# EAGLE design SparkFun_TPL5110_Nano_Power_Switch (EAGLE 9.4.0)
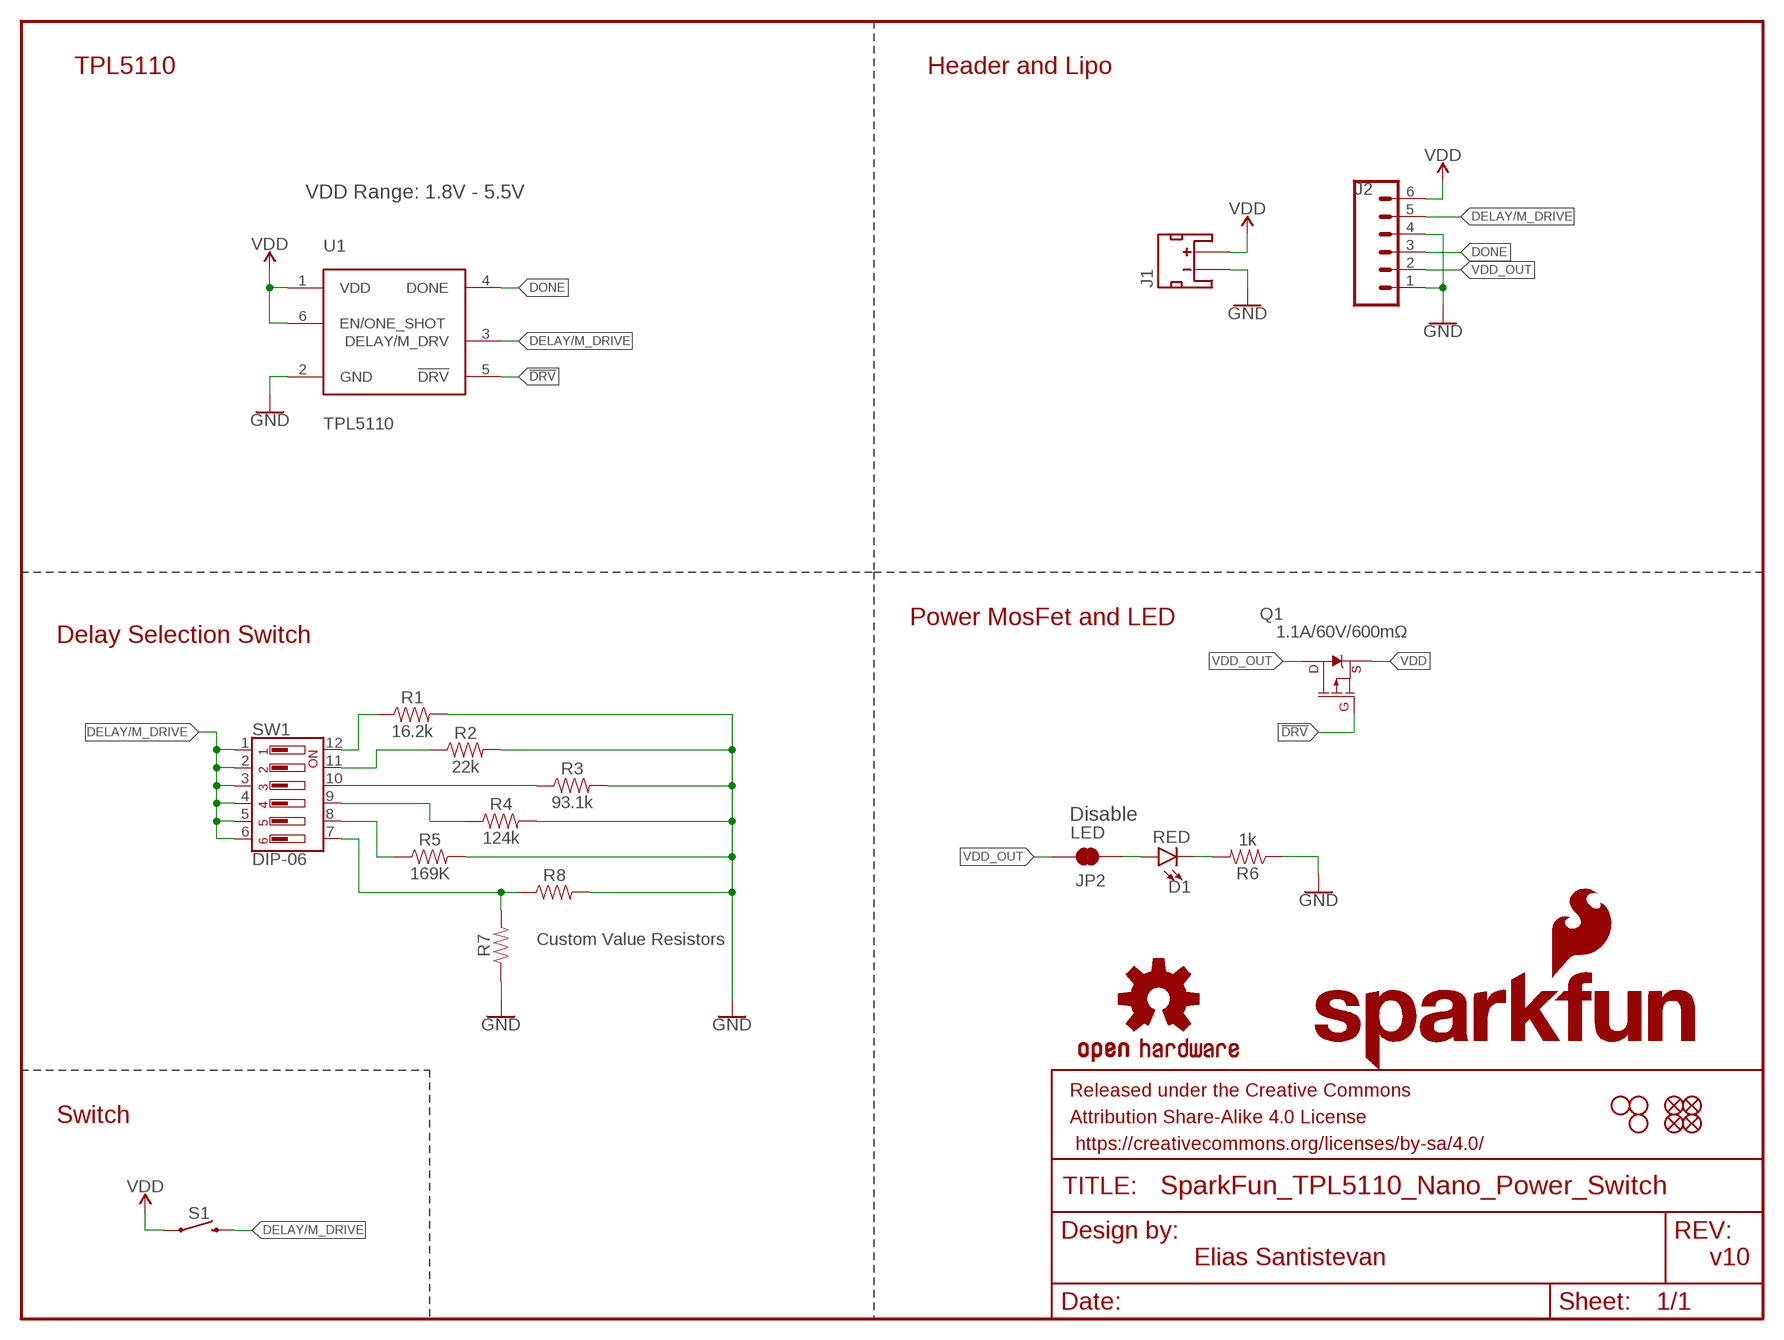
[diagram p0: schematic, sheet 1]

## Parts
D1  RED  LED-RED0603  [LED-0603]
FD1  FIDUCIALUFIDUCIAL  [FIDUCIAL-MICRO]
FD2  FIDUCIALUFIDUCIAL  [FIDUCIAL-MICRO]
FD3  FIDUCIALUFIDUCIAL  [FIDUCIAL-MICRO]
FD4  FIDUCIALUFIDUCIAL  [FIDUCIAL-MICRO]
FRAME1  FRAME-LETTER  [CREATIVE_COMMONS]
H1  STAND-OFFTIGHT  [STAND-OFF-TIGHT]
H2  STAND-OFFTIGHT  [STAND-OFF-TIGHT]
H4  STAND-OFFTIGHT  [STAND-OFF-TIGHT]
J1  JST_2MM_MALE  [JST-2-SMD]
J2  CONN_06NO_SILK_NO_POP  [1X06_NO_SILK]
JP2  LED  JUMPER-SMT_2_NC_TRACE_SILK  [SMT-JUMPER_2_NC_TRACE_SILK]
LOGO1  SFE_LOGO_NAME.1_INCH  [SFE_LOGO_NAME_.1]
LOGO2  OSHW-LOGOS  [OSHW-LOGO-S]
LOGO3  SFE_LOGO_FLAME.1_INCH  [SFE_LOGO_FLAME_.1]
Q1  1.1A/60V/600mΩ  MOSFET_PCH-SI2309DS  [SOT23-3]
R1  16.2k  16.2KOHM-0603-1/10W-1%  [0603]
R2  22k  22KOHM-0603-1/10W-1%  [0603]
R3  93.1k  93.1KOHM  [0603]
R4  124k  124KOHM  [0603]
R5  169K  169KOHM  [0603]
R6  1k  1KOHM-0603-1/10W-1%  [0603]
R7  RESISTOR0603  [0603]
R8  RESISTORAXIAL-0.3  [AXIAL-0.3]
S1  MOMENTARY-SWITCH-SPST-SMD-5.2MM-TALL  [TACTILE_SWITCH_SMD_5.2MM]
SW1  DIP-06  [DIPSWITCH-06-SMD]
U1  TPL5110  [SOT23-6]

## Nets
!DRV: Q1.1(G) U1.5(!DRV)
DELAY/M_DRIVE: J2.5 S1.3 SW1.1 SW1.2 SW1.3 SW1.4 SW1.5 SW1.6 U1.3(DELAY/M_DRV)
DONE: J2.3 U1.4(DONE)
GND: J1.1(-) J2.1 J2.4 R1.2 R2.2 R3.2 R4.2 R5.2 R6.1 R7.1 R8.P$2 U1.2(GND)
N$1: D1.C R6.2
N$4: R1.1 SW1.12
N$5: R2.1 SW1.11
N$6: R3.1 SW1.10
N$7: R4.1 SW1.9
N$8: R5.1 SW1.8
N$9: R7.2 R8.P$1 SW1.7
N$11: D1.A JP2.1
VDD: J1.2(+) J2.6 Q1.2(S) S1.1 U1.1(VDD) U1.6(EN/ONE_SHOT)
VDD_OUT: J2.2 JP2.2 Q1.3(D)
Unconnected: J1.NC1(PAD1) J1.NC2(PAD2)

## Notes on the sheet
- TPL5110 | Header and Lipo
- VDD Range: 1.8V - 5.5V
- Power MosFet and LED
- Delay Selection Switch
- Disable
- Custom Value Resistors
- Switch
- Elias Santistevan | v10

## Library data of the parts
D1 = SparkFun-LED:LED-RED: Red SMD LED Used in manufacturing of most products at SparkFun Packages: 0603 - SMD 0603 package [Product Link] <http://docs.avagotech.com/docs/AV02-0551EN> 0603 SMART - SMD 0603 SMART package ( more efficient and expensive)[Product Link] <http://www.osram-os.com/Graphics/XPic2/00077099_0.pdf> 1206 - SMD1206 package [Product Link] <https://www.sparkfun.com/datasheets/DevTools/LilyPad/Q150OVS4.pdff> SparkFun Products: Pro Mini 328 -5V <https://www.sparkfun.com/products/821> RedBoard <https://www.sparkfun.com/products/12757> IOIO-OTG <https://www.sparkfun.com/products/13613>; PROD_ID: DIO-00819
FD1-FD4 = SparkFun-Aesthetics:FIDUCIAL: Fiducial Alignment Points Point-of-reference for pick-and-place machines and other optical instruments.
FRAME1 = SparkFun-Aesthetics:FRAME-LETTER: Schematic Frame - Letter Standard 8.5x11 US Letter frame
H1 H2 H4 = SparkFun-Hardware:STAND-OFF: Stand Off Drill holes for mechanically mounting via screws, standoffs, etc. Note: Use the keepout ring to avoid running the screw head into surrounding components. Variant Overviews STAND-OFF - Mechanical footprint for a #4 phillips button head screw. STAND-OFF-TIGHT - Mechanical footprint for a #4 phillips button head screw, Example SparkFun Products Screw - Phillips Head (1/4", 4-40, 10 pack) <https://www.sparkfun.com/products/10453> (PRT-10453) Screw - Phillips Head (1/2", 4-40, 10 pack) <https://www.sparkfun.com/products/10452> (PRT-10452) Screw - Phillips Head (3/4", 4-40, 10 pack) <https://www.sparkfun.com/products/10451> (PRT-10451) Screw - Phillips Head (1", 4-40, 10 pack) <https://www.sparkfun.com/products/10450> (PRT-10450)
J1 = SparkFun-Connectors:JST_2MM_MALE: JST 2MM MALE RA CONNECTOR Two pin, compact surface mount connector. Commonly used as a battery input connection point. We really like the solid locking feeling and high current rating on these small connectors. We use these all the time as battery connectors. Mates to single-cell LiPo batteries. Here is the connector we sell at SparkFun: JST Right Angle Connector - White <https://www.sparkfun.com/products/8612> (PRT-08612) Datasheet <http://www.sparkfun.com/datasheets/Prototyping/Connectors/JST-Horizontal.pdf> It was used on these SparkFun products: SparkFun MOSFET Power Controller <https://www.sparkfun.com/products/11214> (PRT-11214) SparkFun Battery Babysitter - LiPo Battery Manager <https://www.sparkfun.com/products/13777> (PRT-13777) And many, many others that required a lipo battery connection.; PROD_ID: CONN-11443; SF_ID: PRT-08612
J2 = SparkFun-Connectors:CONN_06: Multi connection point. Often used as Generic Header-pin footprint for 0.1 inch spaced/style header connections On any of the 0.1 inch spaced packages, you can populate with these: Break Away Headers - Straight <https://www.sparkfun.com/products/116> (PRT-00116) Break Away Male Headers - Right Angle <https://www.sparkfun.com/products/553> (PRT-00553) Female Headers <https://www.sparkfun.com/products/115> (PRT-00115) Break Away Headers - Machine Pin <https://www.sparkfun.com/products/117> (PRT-00117) Break Away Female Headers - Swiss Machine Pin <https://www.sparkfun.com/products/743> (PRT-00743) Arduino Stackable Header - 6 Pin <https://www.sparkfun.com/products/9280> (PRT-09280) For SCREWTERMINALS and SPRING TERMINALS visit here: Screw Terimnals on SparkFun.com <https://www.sparkfun.com/search/results?term=Screw+Terminals> (5mm/3.5mm/2.54mm spacing) This device is also useful as a general connection point to wire up your design to another part of your project. Our various solder wires solder well into these plated through hole pads. Hook-Up Wire - Assortment (Stranded, 22 AWG) <https://www.sparkfun.com/products/11375> (PRT-11375) Hook-Up Wire - Assortment (Solid Core, 22 AWG) <https://www.sparkfun.com/products/11367> (PRT-11367) View the entire wire category on our website here <https://www.sparkfun.com/categories/141>
JP2 = SparkFun-Jumpers:JUMPER-SMT_2_NC_TRACE: Normally closed trace jumper This jumper has a trace between two pads so it's normally closed (NC). Use a razor knife to open the connection. For best results follow the IPC guidelines for cutting traces: Cutout at least 0.063 mm (0.005 in). Remove all loose material to clean up the cut area. Seal the cut with an approved epoxy. Reapply solder to reclose the connection.
LOGO1 = SparkFun-Aesthetics:SFE_LOGO_NAME: SparkFun Font Logo This is the SparkFun name logo. The logo on the schematic will always be the same size; the package variant is the height of the flame part of the logo (or the height the flame would be, if it were drawn). Default layer for the logo on the board is tSilk.
LOGO2 = SparkFun-Aesthetics:OSHW-LOGO: Open-Source Hardware (OSHW) Logo This logo indicates the piece of hardware it is found on incorporates a OSHW license and/or adheres to the definition of open source hardware found here: http://freedomdefined.org/OSHW
LOGO3 = SparkFun-Aesthetics:SFE_LOGO_FLAME: SparkFun Flame Logo This is the SparkFun flame logo. The logo on the schematic will always be the same size; the package variant is the height of the flame. Default layer for the logo on the board is tSilk.
Q1 = SparkFun-DiscreteSemi:MOSFET_PCH: P-channel MOSFETs Voltage controlled devices that allow control of high current outputs. SparkFun Products: SparkFun ESP32 Thing <https://www.sparkfun.com/products/13907> SparkFun ESP8266 Thing <https://www.sparkfun.com/products/13231> SparkFun Pi Servo HAT V2 <https://www.sparkfun.com/products/15316> DMG2305UX-7 (20V/4.2A/SOT23-3); PROD_ID: TRANS-08285
R1 = SparkFun-Resistors:16.2KOHM: 16.2kΩ resistor A resistor is a passive two-terminal electrical component that implements electrical resistance as a circuit element. Resistors act to reduce current flow, and, at the same time, act to lower voltage levels within circuits. - Wikipedia; PROD_ID: RES-12187
R2 = SparkFun-Resistors:22KOHM: 22kΩ resistor A resistor is a passive two-terminal electrical component that implements electrical resistance as a circuit element. Resistors act to reduce current flow, and, at the same time, act to lower voltage levels within circuits. - Wikipedia; PROD_ID: RES-07853
R3 = SparkFun-Resistors:93.1KOHM: 93.1kΩ resistor A resistor is a passive two-terminal electrical component that implements electrical resistance as a circuit element. Resistors act to reduce current flow, and, at the same time, act to lower voltage levels within circuits. - Wikipedia; PROD_ID: RES-14393
R4 = SparkFun-Resistors:124KOHM: 124kΩ resistor A resistor is a passive two-terminal electrical component that implements electrical resistance as a circuit element. Resistors act to reduce current flow, and, at the same time, act to lower voltage levels within circuits. - Wikipedia; PROD_ID: RES-14395
R5 = SparkFun-Resistors:169KOHM: 169kΩ resistor A resistor is a passive two-terminal electrical component that implements electrical resistance as a circuit element. Resistors act to reduce current flow, and, at the same time, act to lower voltage levels within circuits. - Wikipedia; PROD_ID: RES-14394
R6 = SparkFun-Resistors:1KOHM: 1kΩ resistor A resistor is a passive two-terminal electrical component that implements electrical resistance as a circuit element. Resistors act to reduce current flow, and, at the same time, act to lower voltage levels within circuits. - Wikipedia; PROD_ID: RES-07856
R7 R8 = SparkFun-Resistors:RESISTOR: Generic Resistor Package
S1 = SparkFun-Switches:MOMENTARY-SWITCH-SPST: Momentary Switch (Pushbutton) - SPST Normally-open (NO) SPST momentary switches (buttons, pushbuttons). Variants PTH-12MM - 12mm square, through-hole Momentary Pushbutton Switch - 12mm Square <https://www.sparkfun.com/products/9190> (COM-09190) PTH-6.0MM, PTH-6.0MM-KIT - 6.0mm square, through-hole Mini Pushbutton Switch <https://www.sparkfun.com/products/97> (COM-00097) KIT package intended for soldering kit's - only one side of pads' copper is exposed. PTH-RIGHT-ANGLE-KIT - Right-angle, through-hole Right Angle Tactile Button <https://www.sparkfun.com/products/10791> - Used on SparkFun BigTime Watch Kit <https://www.sparkfun.com/products/11734> SMD-12MM - 12mm square, surface-mount Tactile Button - SMD (12mm) <https://www.sparkfun.com/products/12993> (COM-12993) Used on SparkFun PicoBoard <https://www.sparkfun.com/products/11888> SMD-4.5MM - 4.5mm Square Trackball Switch Used on SparkFun Blackberry Trackballer Breakout <https://www.sparkfun.com/products/13169> SMD-4.6MMX2.8MM - 4.60mm x 2.80mm, surface mount Used on SparkFun SAMD21 Mini Breakout <https://www.sparkfun.com/products/13664> SMD-5.2MM, SMD-5.2-REDUNDANT - 5.2mm square, surface-mount Mini Pushbutton Switch - SMD <https://www.sparkfun.com/products/8720> (COM-08720) Used on Arduino Pro Mini <https://www.sparkfun.com/products/11114> REDUNDANT package connects both switch circuits together SMD-6.0X3.5MM - 6.0 x 3.5mm, surface mount Momentary Reset Switch SMD <https://www.sparkfun.com/products/8229> (COM-08229) SMD-6.2MM-TALL - 6.2mm square, surface mount Tactile Button - SMD (6mm) <https://www.sparkfun.com/products/12992> Used on SparkFun Digital Sandbox <https://www.sparkfun.com/products/12651> SMD-RIGHT-ANGLE - Right-angle, surface mount Used on SparkFun Block for Intel® Edison - Arduino <https://www.sparkfun.com/products/13036>; PROD_ID: SWCH-14139
SW1 = SparkFun-Switches:DIP-06; PROD_ID: --------
U1 = SparkFun-IC-Power:TPL5110: TPL5110 Nano-Power System Timer for Power Gating The TPL5110 Nano Timer is a low power timer with an integrated MOSFET driver designed for power gating in duty cycled or battery-powered applications. Consuming only 35 nA, the TPL5110 can enable the power supply line and drastically reduce the overall system stand by current during the sleep time.; PROD_ID: IC-14387

## Board
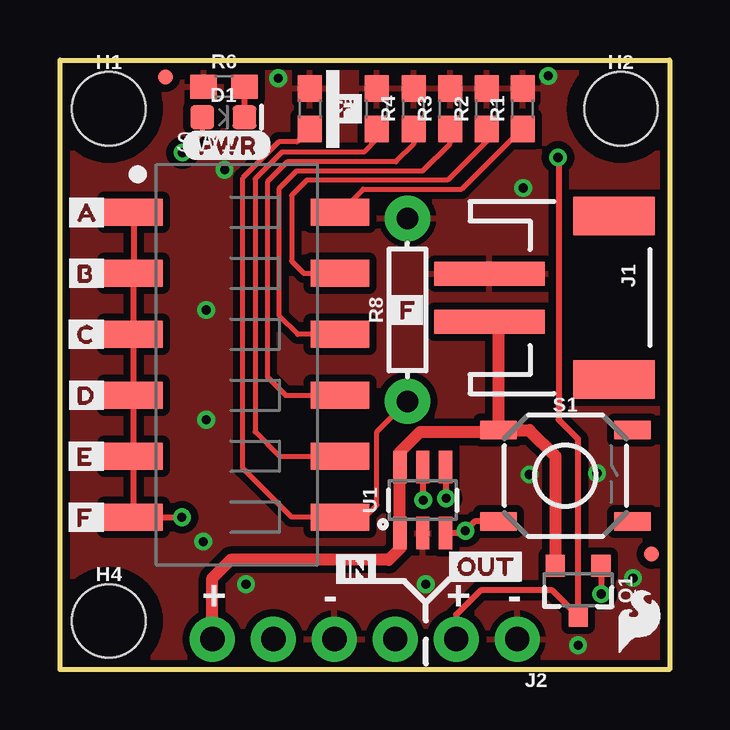
[diagram p1: board, top side]
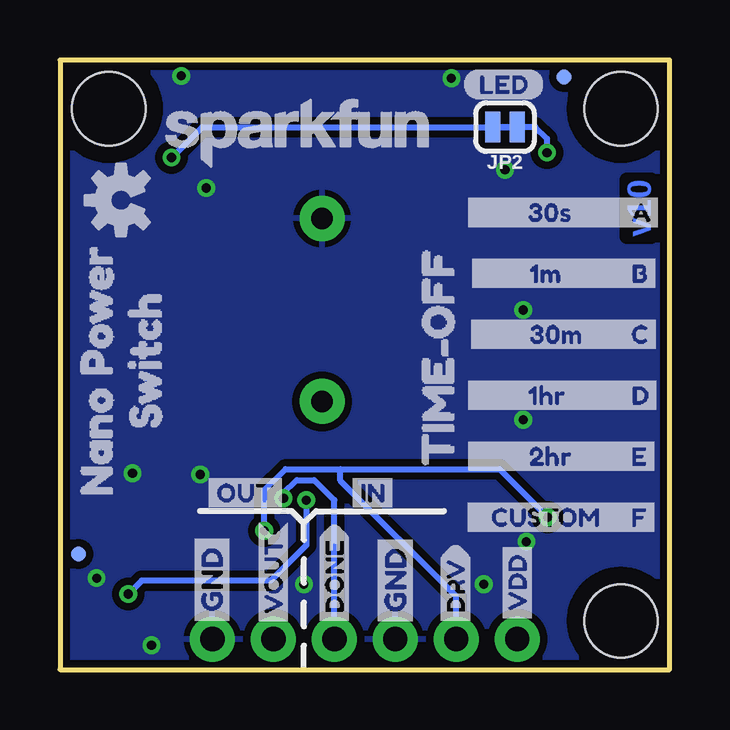
[diagram p2: board, bottom side, seen from below]

Size 25.4 x 25.4 mm. Coordinates in mm from the lower left corner, seen from the top.
Outline: 0,0 0,25.4 25.4,25.4 25.4,0 0,0
Copper layers (1*16): Top 0.035mm / dielectric 1.5mm / Bottom 0.035mm
Design rules "SparkFun-2-layer-TIGHT": minimum track width 7mil, minimum drill 15mil, track to track 7mil, track to pad 7mil, pad to pad 7mil, via to via 7mil, smd to smd 7mil, copper to edge 7mil, drill to drill 7mil, minimum pad ring 7mil, minimum via ring 7mil, stop-mask expansion 4mil, vias tented up to drill 25mil, thermal gap 10mil

### Footprints (pad centres in the part's own frame; a part is rotated, then mirrored left to right if it is on the bottom)
LED-0603 = smd 1 x 1: A -0.877,0; C 0.877,0
FIDUCIAL-MICRO = smd 0.635 x 0.635: 1 0,0
STAND-OFF-TIGHT = hole 3.048: 0,0
JST-2-SMD = smd 1 x 4.6: 1 -1,-3.7; 2 1,-3.7 | smd 1.6 x 3.4: NC1 -3.4,1.5; NC2 3.4,1.5
1X06_NO_SILK = drill 1.016 pad 1.88: 1 0,0; 2 2.54,0; 3 5.08,0; 4 7.62,0; 5 10.16,0; 6 12.7,0
SMT-JUMPER_2_NC_TRACE_SILK = smd 0.635 x 1.27: 1 -0.508,0; 2 0.508,0
SOT23-3 = smd 0.8 x 0.9: 1 -0.95,-1; 2 0.95,-1; 3 0,1.1
0603 = smd 1.1 x 1: 1 -0.85,0; 2 0.85,0
AXIAL-0.3 = drill 0.9 pad 1.88: P$1 -3.81,0; P$2 3.81,0
TACTILE_SWITCH_SMD_5.2MM = smd 1.524 x 0.762: 1 -2.794,1.905; 2 2.794,1.905; 3 -2.794,-1.905; 4 2.794,-1.905
DIPSWITCH-06-SMD = smd 1.13 x 2.44: 1 -6.35,-4.3; 2 -3.81,-4.3; 3 -1.27,-4.3; 4 1.27,-4.3; 5 3.81,-4.3; 6 6.35,-4.3; 7 6.35,4.3; 8 3.81,4.3; 9 1.27,4.3; 10 -1.27,4.3; 11 -3.81,4.3; 12 -6.35,4.3
SOT23-6 = smd 0.55 x 1.35: 1 -0.95,-1.375; 2 0,-1.375; 3 0.95,-1.375; 4 0.95,1.375; 5 0,1.375; 6 -0.95,1.375

### Placement (x,y rotation side)
D1  6.81,23.01 0 top
FD1  4.39,24.69 0 bottom
FD2  4.39,24.69 0 top
FD3  24.64,4.83 0 bottom
FD4  24.64,4.83 0 top
FRAME1  -10.41,-15.49 0 top  (outside the outline)
H1  2.03,23.37 0 top
H2  23.37,23.37 0 top
H4  2.03,2.03 0 top
J1  21.59,15.49 270 top
J2  19.05,1.27 180 top
JP2  6.86,22.61 180 bottom
LOGO1  15.49,22.35 0 bottom
LOGO2  22.86,19.56 90 bottom
LOGO3  24.13,2.03 0 top
Q1  21.59,3.33 180 top
R1  19.28,23.37 90 top
R2  17.78,23.37 90 top
R3  16.26,23.37 90 top
R4  14.73,23.37 90 top
R5  13.21,23.37 90 top
R6  6.83,24.28 0 top
R7  10.41,23.37 270 top
R8  14.48,14.99 90 top
S1  21.06,8.08 0 top
SW1  7.37,12.7 270 top
U1  15.11,7.06 0 top
U$1  [DONE0]  13.97,1.68 90 bottom
U$2  [GND-03]  19.08,1.63 90 bottom
U$3  [VOUT0]  16.51,1.63 90 bottom
U$4  [GND-03]  11.43,1.6 90 bottom
U$5  [VDD0]  6.35,1.78 90 bottom
U$6  [NANO_POWER0]  23.88,6.1 90 bottom
U$7  [SWITCH0]  21.84,8.89 90 bottom
U$8  [1M0]  6.55,16.51 0 bottom
U$9  [30S4]  6.6,19.05 0 bottom
U$10  [30M2]  6.53,13.97 0 bottom
U$11  [1HR3]  6.58,11.43 0 bottom
U$12  [2HR4]  6.55,8.89 0 bottom
U$13  [LED0]  8.64,24.38 0 bottom
U$14  [CUSTOM0]  8.13,6.35 0 bottom
U$15  [TIME#OFF0]  9.65,7.37 90 bottom
U$16  [DRV0]  8.92,1.65 90 bottom
U$17  [A0]  0,19.05 0 top
U$18  [B1]  0,16.51 0 top
U$19  [C2]  0,13.97 0 top
U$20  [D3]  0,11.43 0 top
U$21  [E4]  0,8.89 0 top
U$22  [F5]  0,6.35 0 top
U$23  [F5]  13.46,14.99 0 top
U$24  [F5]  10.92,23.37 0 top
U$25  [A0]  2.29,19.05 0 bottom
U$26  [B1]  2.29,16.51 0 bottom
U$27  [C2]  2.29,13.97 0 bottom
U$28  [D3]  2.29,11.43 0 bottom
U$29  [E4]  2.29,8.89 0 bottom
U$30  [F5]  2.29,6.35 0 bottom
U$31  [IN0]  13.59,7.37 0 bottom
U$32  [OUT1]  19.56,7.37 0 bottom
U$33  [IN0]  11.13,4.19 0 top
U$34  [OUT1]  15.85,4.29 0 top
U$35  [PWR-()-03]  5.08,21.84 0 top

### Tracks (layer width: path | path; a pad name or v marks a point on that pad's centre or on a via)
!DRV  (via drill 0.38)
  Top 0.254: U1.5 15.11,7.09 v15.14,7.06 | Q1.1 22.55,4.31 v22.55,3.15
  Bottom 0.254: v15.14,7.06 15.14,5.18 16.61,3.71 22,3.71 v22.55,3.15
DELAY/M_DRIVE  (via drill 0.38)
  Top 0.254: SW1.1 SW1.2 SW1.3 SW1.4 SW1.5 SW1.6 v5.08,6.35 | U1.3 16.84,5.69 16.89,5.74 v16.89,5.79 17.28,6.17 S1.3
  Bottom 0.254: v5.08,6.35 7.09,8.36 13.72,8.36 | v16.89,5.79 16.89,7.47 16,8.36 13.72,8.36 | 13.72,8.36 13.72,7.87 8.89,3.05 J2.5
DONE  (via drill 0.38)
  Top 0.254: U1.4 16.06,7.16 v16.09,7.14
  Bottom 0.254: v16.09,7.14 16.09,7.34 15.53,7.9 14.81,7.9 13.97,7.06 J2.3
GND  (via drill 0.38)
  other vias: 19.3,20.07 6.86,20.83 9.09,24.64 20.35,24.74 15.24,3.56 7.75,3.56 6.1,14.99 6.1,10.41 19.56,8.13 5.97,5.33 23.88,3.81 21.59,1.02 22.38,8.18
  pour Top (isolate 0.305): 0,25.4 0,0 25.4,0 25.4,25.4
  pour Bottom (isolate 0.305): 0,25.4 0,0 25.4,0 25.4,25.4
N$1
  Top 0.254: R6.2 D1.C
N$4
  Top 0.203: SW1.12 12.63,20.02 16.74,20.02 19.24,22.52 R1.1
N$5
  Top 0.203: R2.1 17.78,22.02 16.15,20.4 10.29,20.4 9.65,19.76 9.65,17.02 10.16,16.51 SW1.11
N$6
  Top 0.203: SW1.10 9.91,13.97 9.14,14.73 9.14,20.07 9.86,20.78 15.11,20.78 16.26,21.92 R3.1
N$7
  Top 0.203: R4.1 14.73,21.89 13.99,21.16 9.47,21.16 8.64,20.32 8.64,12.19 9.4,11.43 SW1.9
N$8
  Top 0.203: R5.1 13.21,22.11 12.66,21.57 9.25,21.57 8.13,20.45 8.13,9.91 9.14,8.89 SW1.8
N$9
  Top 0.203: R7.2 9.88,21.98 9.12,21.98 7.62,20.49 7.62,8.38 9.65,6.35 SW1.7 12.7,6.35 13.21,6.86 13.21,9.91 R8.P$1
N$11  (via drill 0.38)
  Top 0.203: D1.A 5.93,22.36 v5.11,21.54
  Bottom 0.254: v5.11,21.54 5.11,22.12 5.59,22.61 JP2.1
VDD
  Top 0.254: J1.2 18.29,14.1 | S1.1 18.19,9.91 18.29,9.91
  Top 0.508: S1.1 19.56,9.98 20.64,8.9 Q1.2 | 18.19,9.91 15.01,9.91 14.16,9.06 U1.6 U1.1 14.16,5.04 13.69,4.57 7.11,4.57 6.35,3.81 J2.6 | 18.29,9.91 18.29,14.1
VDD_OUT  (via drill 0.38)
  Top 0.254: J2.2 16.51,2.29 17.53,3.3 20.52,3.3 Q1.3 21.59,9.6 20.78,10.41 20.78,21.31 v20.75,21.34
  Bottom 0.254: v20.75,21.34 19.48,22.61 JP2.2

### Text on the board
Bottom: v10
tPlace: + | - | + | -
Measures: Units in Inches
tDocu: Elias Santistevan